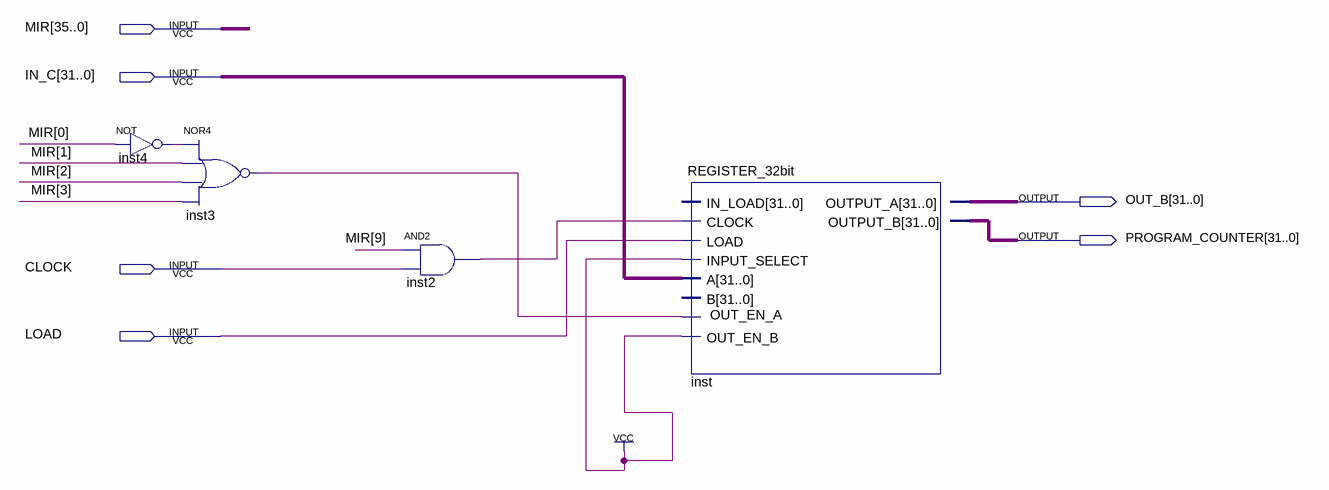
[diagram p0: schematic sheet]
// Quartus schematic PC.bdf as structural Verilog: 4 symbols, 6 pins
module PC (
  input  [35:0] MIR,
  input  [31:0] IN_C,
  input  CLOCK,
  input  LOAD,
  output [31:0] OUT_B,
  output [31:0] PROGRAM_COUNTER
);

  wire inst2_out, inst3_out, inst4_out;

  not inst4 (inst4_out, MIR[0]);
  nor inst3 (inst3_out, inst4_out, MIR[1], MIR[2], MIR[3]);
  and inst2 (inst2_out, MIR[9], CLOCK);
  REGISTER_32bit inst (
    .LOAD(LOAD), .OUT_EN_A(inst3_out), .CLOCK(inst2_out), .OUT_EN_B(1'b1), .INPUT_SELECT(1'b1), .A(IN_C),
    .OUTPUT_A(OUT_B), .OUTPUT_B(PROGRAM_COUNTER));  // open: IN_LOAD, B
endmodule
